# Altium schematic sheet Sheet5.SchDoc
size A; SheetNumber: 3; SheetTotal: 4
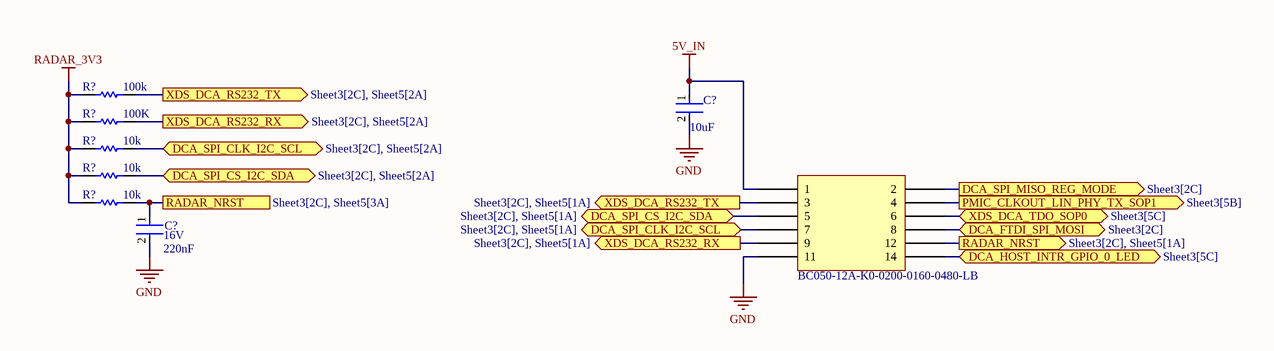
[diagram p0: Sheet5.SchDoc]

## Parts
(Parts that share a designator on the sheet are numbered #1, #2 ... from top to bottom, then left to right.)
C?#1  Capacitance: 10uF  [FP-GRM188-0_2-MFG]  (hidden comment: GRM188C81A106MA73D)
C?#2  Capacitance: 220nF  Voltage Rating: 16V  [FP-CL549-IPC_C]  (hidden comment: CL05B224KO5NNNC)
J?  BC050-12A-K0-0200-0160-0480-LB
R?#1  value 100k  (hidden comment: Resistor)
R?#2  value 100K  (hidden comment: Resistor)
R?#3  10k  [RESC1005X40X25LL05T10]
R?#4  10k  [RESC1005X40X25LL05T10]
R?#5  10k  [RESC1005X40X25LL05T10]

## Ports
DCA_FTDI_SPI_MOSI (bidir, see Sheet3[2C]), DCA_HOST_INTR_GPIO_0_LED (bidir, see Sheet3[5C]), DCA_SPI_CLK_I2C_SCL (bidir, see Sheet3[2C], Sheet5[1A]), DCA_SPI_CLK_I2C_SCL (bidir, see Sheet3[2C], Sheet5[2A]), DCA_SPI_CS_I2C_SDA (bidir, see Sheet3[2C], Sheet5[1A]), DCA_SPI_CS_I2C_SDA (bidir, see Sheet3[2C], Sheet5[2A]), DCA_SPI_MISO_REG_MODE (out, see Sheet3[2C]), PMIC_CLKOUT_LIN_PHY_TX_SOP1 (out, see Sheet3[5B]), RADAR_NRST (out, see Sheet3[2C], Sheet5[1A]), RADAR_NRST (see Sheet3[2C], Sheet5[3A]), XDS_DCA_RS232_RX (out, see Sheet3[2C], Sheet5[1A]), XDS_DCA_RS232_RX (out, see Sheet3[2C], Sheet5[2A]), XDS_DCA_RS232_TX (out, see Sheet3[2C], Sheet5[1A]), XDS_DCA_RS232_TX (out, see Sheet3[2C], Sheet5[2A]), XDS_DCA_TDO_SOP0 (bidir, see Sheet3[5C])

## Nets
5V_IN: C?#1.1 J?.M25(1)
GND: C?#1.2 C?#2.2 J?.M30(11)
RADAR_3V3: R?#1.1 R?#2.1 R?#3.1 R?#4.1 R?#5.1
DCA_FTDI_SPI_MOSI: J?.M27(8) ; port DCA_FTDI_SPI_MOSI
DCA_HOST_INTR_GPIO_0_LED: J?.M25(14) ; port DCA_HOST_INTR_GPIO_0_LED
DCA_SPI_CLK_I2C_SCL: J?.7 R?#3.2 ; port DCA_SPI_CLK_I2C_SCL
DCA_SPI_CS_I2C_SDA: J?.M27(5) R?#4.2 ; port DCA_SPI_CS_I2C_SDA
DCA_SPI_MISO_REG_MODE: J?.M30(2) ; port DCA_SPI_MISO_REG_MODE
PMIC_CLKOUT_LIN_PHY_TX_SOP1: J?.M29(4) ; port PMIC_CLKOUT_LIN_PHY_TX_SOP1
RADAR_NRST: C?#2.1 J?.M26(12) R?#5.2 ; port RADAR_NRST
XDS_DCA_RS232_RX: J?.M29(9) R?#2.2 ; port XDS_DCA_RS232_RX
XDS_DCA_RS232_TX: J?.M26(3) R?#1.2 ; port XDS_DCA_RS232_TX
XDS_DCA_TDO_SOP0: J?.M28(6) ; port XDS_DCA_TDO_SOP0

## Library data of the parts
C?#1 = CMP-06035-002932-1: Chip Multilayer Ceramic Capacitors for General Purpose, 0603, 10uF, X6S, 22%, 20%, 10V; Case Code (Metric): 1608; Max Operating Temperature: 105°C; Voltage Rating (DC): 10V; Thickness: 0.031inch; Width: 0.031inch; Dielectric: X6S; Lead Free: Lead Free; REACH SVHC: No SVHC; Case/Package: 0603; Length: 0.063inch; Min Operating Temperature: -55°C; Package Quantity: 4000; Voltage Rating: 10V; Tolerance: 20%; Packaging: Cut Tape; Material: Ceramic; Mount: Surface Mount; Case Code (Imperial): 0603; Height: 0.8mm
C?#2 = CMP-13271-002972-1: Cap Ceramic 220nF 16V X7R ±10% SMD 0402 +125°C Paper T/R; Length: 1mm; Case Code (Metric): 1005; Dielectric: X7R; Thickness: 0.022inch; Packaging: Tape and Reel; Width: 0.02inch; Max Operating Temperature: 125°C; Tolerance: 10%; Depth: 0.5mm; Radiation Hardening: No; Case Code (Imperial): 0402; Height: 0.5mm; Package Quantity: 1; Mount: Surface Mount; Case/Package: 0402; Min Operating Temperature: -55°C
J? = BC050-12A-K0-0200-0160-0480-LB: Cross Referenced to GCT GLOBAL CONN TECH INC - Part GCTBC050-12A-K0-0200-0160-0480-LB; Manufacturer: Global Connector Technology; Contact Resistance: 20mΩ; Current Rating: 1A; Dielectric Material: Liquid Crystal Polymer; Insulation Resistance: 1GΩ; Number of Contacts: 12; Row Spacing: 4.3mm; Voltage Rating: 250V; Supplier: DigiKey; Supplier Part Number: 2073-BC050-12A-K0-0200-0160-0480-LBCT-ND; Manufacturer Part Number: BC050-12A-K0-0200-0160-0480-LB; RoHS: Compliant; Category: Card Edge Connectors; Stock: 1162; Pricing: 1=1.32, 10=1.124, 100=0.9548, 500=0.85222 (USD); China RoHS: Compliant; Contact Gender: Male; Contact Material: Gold, Nickel; Country of Origin: Mainland China; Export Control Classification Number (ECCN) Code: EAR99; Height: 4.1mm; Harmonized Tariff Schedule (HTS) Code: 8536.69.40.40; Introduction Date: 2009-12-21; Lifecycle Status: Production; Max Operating Temperature: 105°C; Min Operating Temperature: -40°C; Pins: 12; Number of Rows: 2; Orientation: Vertical; REACH SVHC: Yes; Terminal Pitch: 1mm; ComponentLink1URL: https://datasheet.octopart.com:443/BC050-12A-K0-0200-0160-0480-LB-Global-Connector-Technology-datasheet-170668596.pdf?src-supplier=IHS; ComponentLink1Description: https://datasheet.octopart.com:443/BC050-12A-K0-0200-0160-0480-LB-Global-Connector-Technology-datasheet-170668596.pdf?src-supplier=IHS; ComponentLink2URL: https://datasheet.octopart.com:443/BC050-12A-K0-0200-0160-0480-LB-GCT-datasheet-177708336.pdf?src-supplier=Sager+Electronics; ComponentLink2Description: https://datasheet.octopart.com:443/BC050-12A-K0-0200-0160-0480-LB-GCT-datasheet-177708336.pdf?src-supplier=Sager+Electronics; ComponentLink3URL: https://datasheet.octopart.com:443/BC050-12A-K0-0200-0160-0480-LB-GCT-datasheet-91940675.pdf?src-supplier=TME; ComponentLink3Description: https://datasheet.octopart.com:443/BC050-12A-K0-0200-0160-0480-LB-GCT-datasheet-91940675.pdf?src-supplier=TME
R?#1 = Resistor: TC1: 0; SimulationGenericComponent: True; TC2: 0; Supplier: DigiKey; Supplier Part Number: 1292-WR04X1003FTLCT-ND
R?#2 = Resistor: 62.5mW Thick Film Resistors 50V ±100ppm/℃ ±1% 100kΩ 0402 Chip Resistor - Surface Mount ROHS; Manufacturer: Walsin Technologies; Manufacturer Part Number: WR04X1003FTL; TC1: 0; SimulationGenericComponent: True; Temperature Coefficient: 100ppm/°C; TC2: 0; Supplier: DigiKey; Supplier Part Number: 1292-WR04X1003FTLCT-ND; RoHS: Compliant; Category: Chip SMD Resistors; Stock: 2141811; Pricing: 1=0.1, 10=0.013, 25=0.0088, 50=0.007, 100=0.0055, 250=0.00404, 500=0.00328, 1000=0.00268, 5000=0.00259, 10000=0.00117, 20000=0.00111, 30000=0.0011, 50000=0.00109, 70000=0.00103, 100000=0.00097, 120000=0.00094, 240000=0.00094 (USD); Case/Package: 0402; Case Code (Imperial): 0402; Case Code (Metric): 1005; Composition: Metal Oxide, Thick Film; Contact Material: Tin; Depth: 500µm; Export Control Classification Number (ECCN) Code: EAR99; Height: 350µm; Harmonized Tariff Schedule (HTS) Code: 8533.21.00.30; Introduction Date: 2006-12-27; Lead Free: Lead Free; Length: 1mm; Lifecycle Status: Production; Max Operating Temperature: 155°C; Military Standard: Not; Min Operating Temperature: -55°C; Mounting Technology: Surface Mount; Number of Terminals: 2; Packaging: Cut Tape; Power Dissipation: 62.5mW; Power Rating: 62.5mW; REACH SVHC: Yes; Schedule B: 8533210045|8533210045|8533210045|8533210045|8533210045|8533210045|8533210045|8533210045|8533210045, 8533210045|8533210045|8533210045|8533210045|8533210045|8533210045|8533210045|8533210045|8533210045|8533210045, 8533210045|8533210045|8533210045|8533210045|8533210045|8533210045|8533210045|8533210045|8533210045|8533210045|8533210045, 8533210045|8533210045|8533210045|8533210045|8533210045|8533210045|8533210045|8533210045|8533210045|8533210045|8533210045|8533210045; Termination: SMD/SMT; Tolerance: 1%; Voltage Rating: 50V; Voltage Rating (DC): 50V; Width: 500µm; Working Voltage: 50V; ComponentLink1URL: https://datasheet.octopart.com:443/WR04X1003FTL-Walsin-Technologies-datasheet-182189174.pdf?src-supplier=IHS; ComponentLink1Description: https://datasheet.octopart.com:443/WR04X1003FTL-Walsin-Technologies-datasheet-182189174.pdf?src-supplier=IHS; ComponentLink2URL: https://datasheet.octopart.com:443/WR04X1003FTL-Walsin-Technologies-datasheet-128065753.pdf?src-supplier=ODG+(Origin+Data+Global); ComponentLink2Description: https://datasheet.octopart.com:443/WR04X1003FTL-Walsin-Technologies-datasheet-128065753.pdf?src-supplier=ODG+(Origin+Data+Global); ComponentLink3URL: https://datasheet.octopart.com:443/WR04X1003FTL-Walsin-Technologies-datasheet-48038251.pdf?src-supplier=element14+APAC; ComponentLink3Description: https://datasheet.octopart.com:443/WR04X1003FTL-Walsin-Technologies-datasheet-48038251.pdf?src-supplier=element14+APAC; ComponentLink4URL: https://datasheet.octopart.com:443/WR04X1003FTL-Walsin-Technologies-datasheet-158279492.pdf?src-supplier=TME; ComponentLink4Description: https://datasheet.octopart.com:443/WR04X1003FTL-Walsin-Technologies-datasheet-158279492.pdf?src-supplier=TME; ComponentLink5URL: https://datasheet.octopart.com/WR04X1003FTL-Walsin-Technologies-datasheet-32780790.pdf; ComponentLink5Description: https://datasheet.octopart.com/WR04X1003FTL-Walsin-Technologies-datasheet-32780790.pdf; ComponentLink6URL: https://datasheet.octopart.com:443/WR04X1003FTL-Walsin-Technologies-datasheet-12511171.pdf?src-supplier=Future+Electronics; ComponentLink6Description: https://datasheet.octopart.com:443/WR04X1003FTL-Walsin-Technologies-datasheet-12511171.pdf?src-supplier=Future+Electronics
R?#3-R?#5 = CMP-2002-07353-1: Part Number: RC0402FR-0710KL; Manufacturer: Yageo / Phycomp